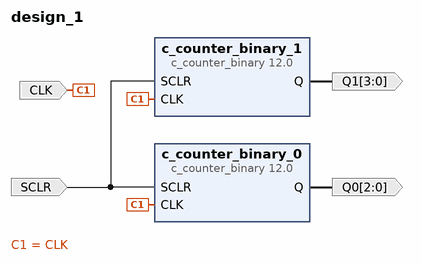
[diagram p0: block diagram of the top level]
# Vivado block design design_1, xc7s6cpga196-1, Vivado 2018.2
create_bd_design design_1

create_bd_port -dir I -type clk CLK
set_property -dict {CONFIG.FREQ_HZ 10000000} [get_bd_ports CLK]
create_bd_port -dir O -from 2 -to 0 -type data Q0
create_bd_port -dir O -from 3 -to 0 -type data Q1
create_bd_port -dir I -type rst SCLR
set_property -dict {CONFIG.POLARITY ACTIVE_HIGH} [get_bd_ports SCLR]

create_bd_cell -type ip -vlnv xilinx.com:ip:c_counter_binary:12.0 c_counter_binary_0
set_property -dict {CONFIG.Output_Width 3 CONFIG.SCLR true} [get_bd_cells c_counter_binary_0]
create_bd_cell -type ip -vlnv xilinx.com:ip:c_counter_binary:12.0 c_counter_binary_1
set_property -dict {CONFIG.Output_Width 4 CONFIG.SCLR true} [get_bd_cells c_counter_binary_1]

# ---- connections ----

connect_bd_net [get_bd_ports CLK] [get_bd_pins c_counter_binary_0/CLK] [get_bd_pins c_counter_binary_1/CLK]
connect_bd_net [get_bd_pins c_counter_binary_0/Q] [get_bd_ports Q0]
connect_bd_net [get_bd_pins c_counter_binary_1/Q] [get_bd_ports Q1]
connect_bd_net [get_bd_ports SCLR] [get_bd_pins c_counter_binary_0/SCLR] [get_bd_pins c_counter_binary_1/SCLR]

validate_bd_design
save_bd_design
